# Altium schematic sheet 发送端V01.SchDoc
size A3
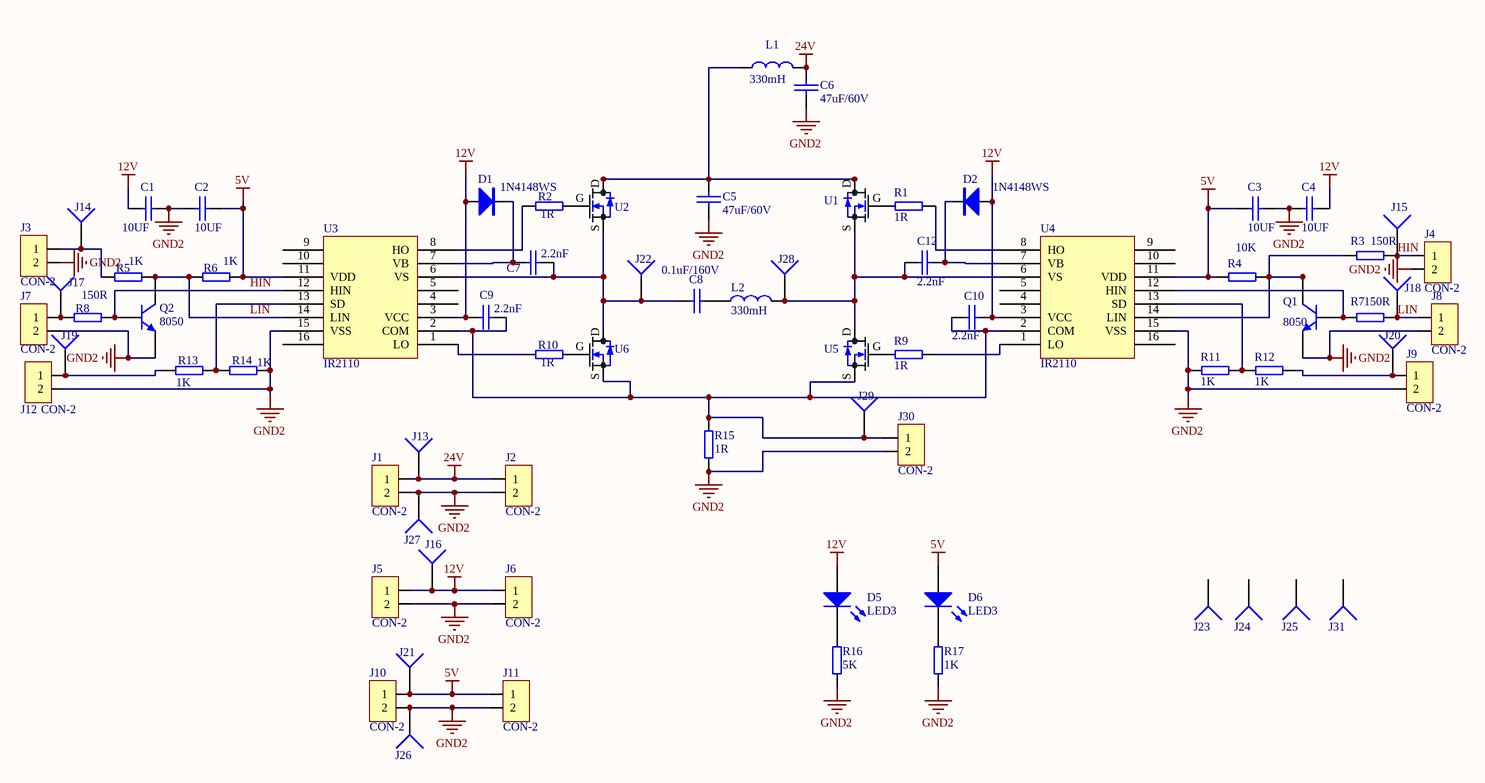
[diagram p0: 发送端V01.SchDoc]

## Parts
C1  10UF  [1206_C]
C2  10UF  [1206_C]
C3  10UF  [1206_C]
C4  10UF  [1206_C]
C5  47uF/60V  [C3618]
C6  47uF/60V  [C3618]
C7  2.2nF  [1206_C]
C8  0.1uF/160V  [DSMC82]
C9  2.2nF  [1206_C]
C10  2.2nF  [1206_C]
C12  2.2nF  [1206_C]
D1  1N4148WS  [SOD-123]
D2  1N4148WS  [SOD-123]
D5  LED3  [1206_R]
D6  LED3  [1206_R]
J1  CON-2  [F396P2-1]
J2  CON-2  [F396P2-1]
J3  CON-2  [GPSPIN]
J4  CON-2  [GPSPIN]
J5  CON-2  [F396P2-1]
J6  CON-2  [F396P2-1]
J7  CON-2  [GPSPIN]
J8  CON-2  [GPSPIN]
J9  CON-2  [HDR1X2]
J10  CON-2  [F396P2-1]
J11  CON-2  [F396P2-1]
J12  CON-2  [HDR1X2]
J13  Socket  [JET]  (value not drawn)
J14  Socket  [JET]  (value not drawn)
J15  Socket  [JET]  (value not drawn)
J16  Socket  [JET]  (value not drawn)
J17  Socket  [JET]  (value not drawn)
J18  Socket  [JET]  (value not drawn)
J19  Socket  [JET]  (value not drawn)
J20  Socket  [JET]  (value not drawn)
J21  Socket  [JET]  (value not drawn)
J22  Socket  [JET]  (value not drawn)
J23  Socket  [M3]  (value not drawn)
J24  Socket  [M3]  (value not drawn)
J25  Socket  [M3]  (value not drawn)
J26  Socket  [JET]  (value not drawn)
J27  Socket  [JET]  (value not drawn)
J28  Socket  [JET]  (value not drawn)
J29  Socket  [JET]  (value not drawn)
J30  CON-2  [HDR1X2]
J31  Socket  [M3]  (value not drawn)
L1  330mH  [H3.3]
L2  330mH  [DSMC82]
Q1  8050  [SOT-23(SOT-23-3)]
Q2  8050  [SOT-23(SOT-23-3)]
R1  1R  [1206_R]
R2  1R  [1206_R]
R3  150R  [1206_R]
R4  10K  [1206_R]
R5  1K  [1206_R]
R6  1K  [1206_R]
R7  150R  [1206_R]
R8  150R  [1206_R]
R9  1R  [1206_R]
R10  1R  [1206_R]
R11  1K  [1206_R]
R12  1K  [1206_R]
R13  1K  [1206_R]
R14  1K  [1206_R]
R15  1R  [R10MR10MM1D5]
R16  5K  [1206_R]
R17  1K  [1206_R]
U1  NMOS  [TO-220]  (value not drawn)
U2  NMOS  [TO-220]  (value not drawn)
U3  IR2110  [SOIC-16_300mil]
U4  IR2110  [SOIC-16_300mil]
U5  NMOS  [TO-220]  (value not drawn)
U6  NMOS  [TO-220]  (value not drawn)

## Nets
5V: C2.1 C3.1 D6.1(A) J10.1 J11.1 J21.1 R4.2 R6.2 U3.11(VDD) U4.11(VDD)
12V: C1.2 C4.2 C9.2 C10.2 D1.1(A) D2.1(A) D5.1(A) J5.1 J6.1 J16.1 U3.3(VCC) U4.3(VCC)
24V: C6.1 J1.1 J2.1 J13.1 L1.1
GND2: C1.1 C2.2 C3.2 C4.1 C5.2 C6.2 J1.2 J2.2 J3.2 J4.2 J5.2 J6.2 J7.2 J8.2 J9.2 J10.2 J11.2 J12.2 J26.1 J27.1 J30.2 Q1.2(E) Q2.2(E) R11.2 R14.2 R15.1 R16.1 R17.1 U3.15(VSS) U4.15(VSS)
HIN: J4.1 J15.1 Q2.1(B) R3.1 R8.2 U3.12(HIN)
LIN: J8.1 J18.1 Q2.3(C) R5.2 R6.1 R7.1 U3.14(LIN)
NetC5_1: C5.1 L1.2 U1.D U2.D
NetC7_1: C7.1 C8.1 J22.1 U2.S U3.6(VS) U6.D
NetC7_2: C7.2 D1.2(K) U3.7(VB)
NetC8_2: C8.2 L2.2
NetC9_1: C9.1 C10.1 J29.1 J30.1 R15.2 U3.2(COM) U4.2(COM) U5.S U6.S
NetC12_1: C12.1 J28.1 L2.1 U1.S U4.6(VS) U5.D
NetC12_2: C12.2 D2.2(K) U4.7(VB)
NetD5_2: D5.2(K) R16.2
NetD6_2: D6.2(K) R17.2
NetJ3_1: J3.1 J14.1 R5.1
NetJ7_1: J7.1 J17.1 R8.1
NetJ9_1: J9.1 J20.1 R12.1
NetJ12_1: J12.1 J19.1 R13.1
NetQ1_1: Q1.1(B) R7.2 U4.12(HIN)
NetQ1_3: Q1.3(C) R3.2 R4.1 U4.14(LIN)
NetR1_1: R1.1 U4.8(HO)
NetR1_2: R1.2 U1.G
NetR2_1: R2.1 U3.8(HO)
NetR2_2: R2.2 U2.G
NetR9_1: R9.1 U4.1(LO)
NetR9_2: R9.2 U5.G
NetR10_1: R10.1 U3.1(LO)
NetR10_2: R10.2 U6.G
NetR11_1: R11.1 R12.2 U4.13(SD)
NetR13_2: R13.2 R14.1 U3.13(SD)

Not connected (* = marked no-connect by the designer): J23 1; J24 1; J25 1; J31 1; U3 4 5 9 10 16; U4 4 5 9 10 16

## Library data of the parts
C1-C10 C12 = CAP
D1 D2 = 1N4148: 1N4148WS IN4148 0805 SOD323 丝印T4 贴片开关二极管
D5 D6 = LED3: Typical BLUE SiC LED; Published: 8-Jun-2000; LatestRevisionDate: 17-Dec-2003; LatestRevisionNote: PCB Footprint replaced.; DatasheetVersion: 16-Apr-2002; PackageVersion: 16-Apr-2002; PackageReference: 3.5X2.8X1.9; Publisher: Altium Limited; PackageDescription: SM LED; 2 C-Bend Leads; Body 3.5 x 2.8 x 1.9 mm, inc leads (LxWxH typ)
L1 L2 = INL: CD75--2.2mH 222M 贴片功率电感绕线功率电感 7*7.8*5mm
Q1 Q2 = SOT-23 2SC3356-T1B-A    S/YS档: 三极管; ComponentLink1Description: 供应商链接; ComponentLink1URL: http://www.szlcsc.com/product/details_10189.html; Package: SOT-23; Supplier: LC; SuppliersPartNumber: C9659
R1-R17 = RES
J13-J29 J31 = Socket: LatestRevisionDate: 17-Jul-2002; LatestRevisionNote: Re-released for DXP Platform.; Publisher: Altium Limited